# Altium schematic sheet Sheet1_V2.SchDoc
size A; SheetNumber: 1; SheetTotal: 1
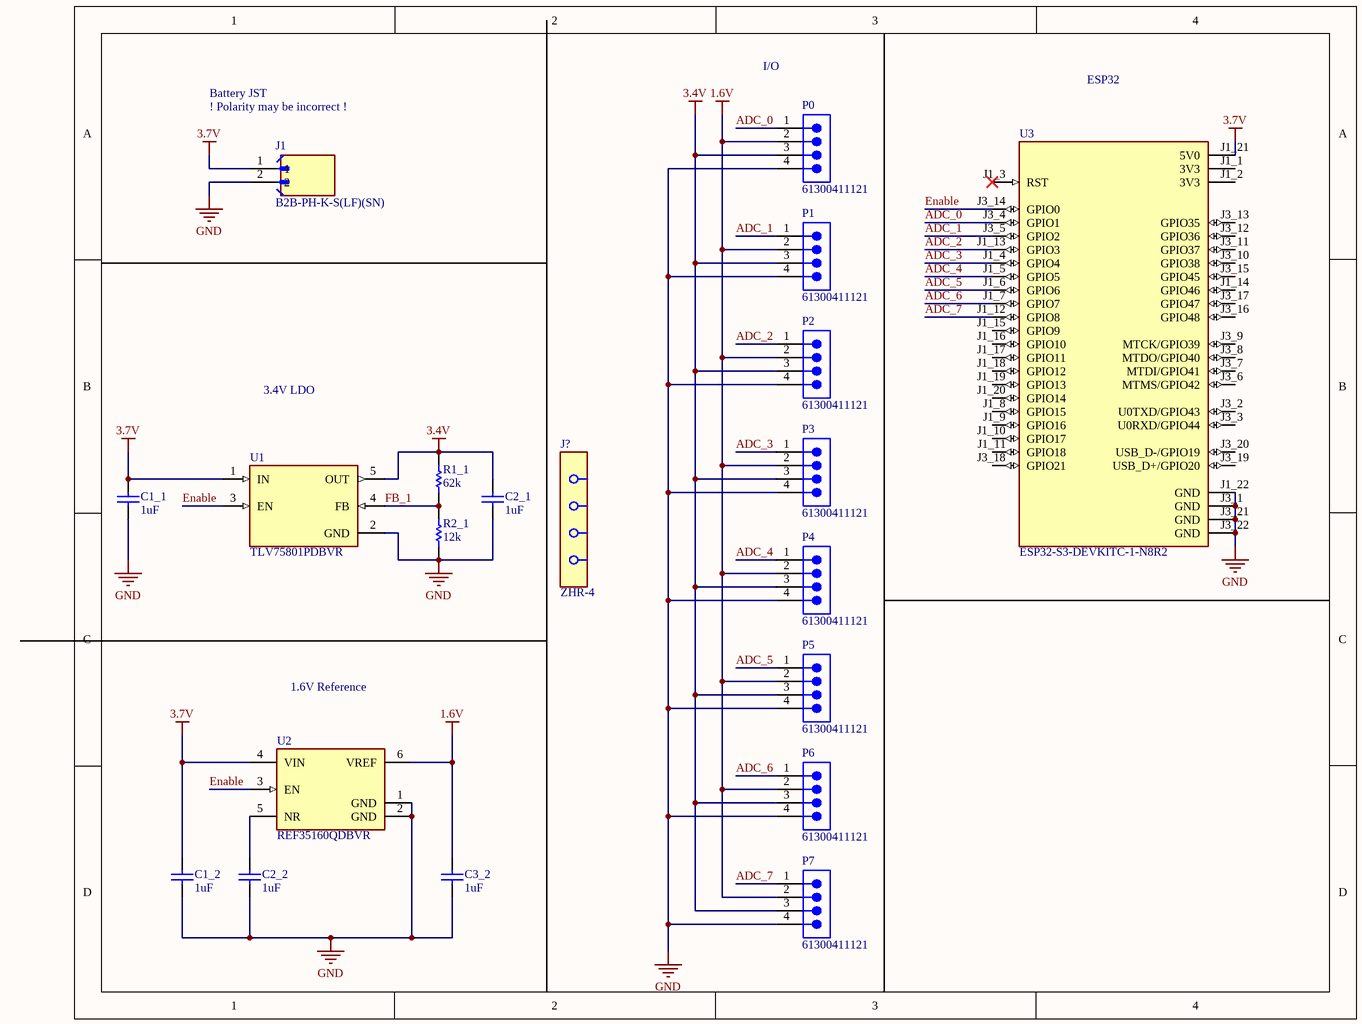
[diagram p0: Sheet1_V2.SchDoc]

## Parts
C1_1  1uF  [CAPC3216X110X50LL20T25]
C1_2  1uF  [CAPC3216X110X50LL20T25]
C2_1  1uF  [CAPC3216X110X50LL20T25]
C2_2  1uF  [CAPC3216X110X50LL20T25]
C3_2  1uF  [CAPC3216X110X50LL20T25]
J1  B2B-PH-K-S(LF)(SN)  [JST_B2B-PH-K-S(LF)(SN)]
J?  ZHR-4  [FP-ZHR-4-MFG]
P0  61300411121  [61300411121]
P1  61300411121  [61300411121]
P2  61300411121  [61300411121]
P3  61300411121  [61300411121]
P4  61300411121  [61300411121]
P5  61300411121  [61300411121]
P6  61300411121  [61300411121]
P7  61300411121  [61300411121]
R1_1  62k  [RESC3216X70X50LL20T25]
R2_1  12k  [RESC3216X70X50NL20T25]
U1  TLV75801PDBVR  [SOT95P280X145-5N]
U2  REF35160QDBVR  [FP-DBV0006A-IPC_A]
U3  ESP32-S3-DEVKITC-1-N8R2  [XCVR_ESP32-S3-DEVKITC-1-N8R2]

## Nets
1.6V: C3_2.2 P0.2 P1.2 P2.2 P3.2 P4.2 P5.2 P6.2 P7.2 U2.6(VREF)
3.4V: C2_1.1 P0.3 P1.3 P2.3 P3.3 P4.3 P5.3 P6.3 P7.3 R1_1.2 U1.5(OUT)
3.7V: C1_1.2 C1_2.2 J1.1 U1.1(IN) U2.4(VIN) U3.J1_21(5V0)
GND: C1_1.1 C1_2.1 C2_1.2 C2_2.1 C3_2.1 J1.2 P0.4 P1.4 P2.4 P3.4 P4.4 P5.4 P6.4 P7.4 R2_1.1 U1.2(GND) U2.1(GND) U2.2(GND) U3.J1_22(GND) U3.J3_1(GND) U3.J3_21(GND) U3.J3_22(GND)
ADC_0: P0.1 U3.J3_4(GPIO1)
ADC_1: P1.1 U3.J3_5(GPIO2)
ADC_2: P2.1 U3.J1_13(GPIO3)
ADC_3: P3.1 U3.J1_4(GPIO4)
ADC_4: P4.1 U3.J1_5(GPIO5)
ADC_5: P5.1 U3.J1_6(GPIO6)
ADC_6: P6.1 U3.J1_7(GPIO7)
ADC_7: P7.1 U3.J1_12(GPIO8)
Enable: U1.3(EN) U2.3(EN) U3.J3_14(GPIO0)
FB_1: R1_1.1 R2_1.2 U1.4(FB)
NetC2_2_2: C2_2.2 U2.5(NR)

Not connected (* = marked no-connect by the designer): U3 J1_1(3V3) J1_2(3V3) J1_3(RST)* J1_8(GPIO15) J1_9(GPIO16) J1_10(GPIO17) J1_11(GPIO18) J1_14(GPIO46) J1_15(GPIO9) J1_16(GPIO10) J1_17(GPIO11) J1_18(GPIO12) J1_19(GPIO13) J1_20(GPIO14) J3_2(U0TXD/GPIO43) J3_3(U0RXD/GPIO44) J3_6(MTMS/GPIO42) J3_7(MTDI/GPIO41) J3_8(MTDO/GPIO40) J3_9(MTCK/GPIO39) J3_10(GPIO38) J3_11(GPIO37) J3_12(GPIO36) J3_13(GPIO35) J3_15(GPIO45) J3_16(GPIO48) J3_17(GPIO47) J3_18(GPIO21) J3_19(USB_D+/GPIO20) J3_20(USB_D-/GPIO19)

## Notes on the sheet
- Battery JST
- I/O
- ESP32
- ! Polarity may be incorrect !
- 3.4V LDO
- 1.6V Reference

## Library data of the parts
C1_1 C1_2 C2_1 C2_2 C3_2 = CMP-2000-06011-1: Chip Capacitor, 1 uF, +/- 10%, 50 V, -55 to 125 degC, 1206 (3216 Metric), RoHS, Tape and Reel; Manufacturer: Kemet; Case Height: 1mm; Dielectric: X7R; Voltage Rating: 50V; Temperature Coefficient / Code: +/-15%; Case Length: 3.2mm; Case Width: 1.6mm; Type: SMDMLCCX7R6.3-250VDCCommericalGrade; Class: Class1; Capacitance - nF: 1000nF; Datasheet URL: http://www.kemet.com/docfinder?Partnumber=C1206C105K5RACTU; Product Category: MultilayerCeramicCapacitorsMLCC-SMD/SMT; Capacitance: 1uF; Termination Style: SMD/SMT; Dimensions: 1.6mmWx3.2mmLx1mmH; Voltage Rating DC: 50V; Datasheet Version: 02/2016; Packaging: Reel; Brand: Kemet; RoHS: Details; Minimum Operating Temperature: -55C; Operating Temperature Range: -55Cto+125C; Package Reference: 1206; Manufacturer URL: http://www.kemet.com/; Product: GeneralTypeMLCCs; Tolerance: 10%; Package Description: 2-Pin Surface Mount Device, Body 3.2 x 1.6 mm; Mounting Technology: SurfaceMount; Case Code - mm: 3216; Maximum Operating Temperature: +125C; Series: C1206C; Factory Pack Quantity: 2500; Package / Case: 1206(3216metric); Case Code - in: 1206
J1 = B2B-PH-K-S(LF)(SN): Connector Header Through Hole 2 position 0.079 (2.00mm); MF: JST; SnapEDA_Link: https://www.snapeda.com/parts/B2B-PH-K-S%20(LF)(SN)/JST/view-part/?ref=snap; Package: None; Value: *; MP: B2B-PH-K-S (LF)(SN); Check_prices: https://www.snapeda.com/parts/B2B-PH-K-S%20(LF)(SN)/JST/view-part/?ref=eda
J? = CMP-17439-000043-1: CONN HOUSING ZH 4POS 1.5MM WHT; Voltage Rating (AC): 50V; Test Voltage: 500V; Number of Contacts: 4; Contact Resistance: 20mR; Gender: Female; Max Current Rating: 1A; Insulation Resistance: 500MR; Panel Thickness: 3.5mm; Connector Type: Receptacle; Housing Material: Polyamide; Insulation Material: Nylon; Packaging: Bulk; Contact Type: Female Socket; Width: 3.4mm; Pitch: 1.5mm; Min Operating Temperature: -25°C; Orientation: Straight; Contact Material: Brass; Max Voltage Rating (AC): 50V; Number of Positions: 4; REACH SVHC: No SVHC; Color: Natural; Mount: Free Hanging; Housing Color: White; Flammability Rating: UL94 V-0; Depth: 4.8mm; Height: 0.28inch; Contact Plating: Tin; Material: Nylon; Number of Rows: 1; Voltage Rating (DC): 50V; Series: ZH; Length: 7.5mm; Weight: 0.0625lb; Termination: Crimp; Max Operating Temperature: 85°C; Current Rating: 1A; Lead Free: Lead Free
P0-P7 = CMP-1502-01064-3: NexarPartId: 32855522; Operating Supply Voltage: 250V; Pitch: 2.54mm; Contact Resistance: 20mΩ; Number of Positions: 4; Current Rating: 3A; Connector Type: Male Pin; Gender: Male; Contact Plating: Gold; Height: 8.89mm; Lead Pitch: 2.54mm; Lead Free: Lead Free; Contact Mating Length: 5.9944mm; Number of Rows: 1; Termination: Solder; Packaging: Bulk; REACH SVHC: Unknown; Min Operating Temperature: -40°C; RoHS: Compliant; Number of Contacts: 4; Voltage Rating: 250V; Color: Black; Max Operating Temperature: 105°C; Contact Material: Copper; Mount: Through Hole; Orientation: Vertical; Number of Pins: 4
R1_1 = CMP-2003-04487-1: Part Number: ERA8AEB623V; Manufacturer: Panasonic
R2_1 = CMP-2003-04416-1: Part Number: ERA8AEB123V; Manufacturer: Panasonic
U1 = TLV75801PDBVR: 500-mA, low-IQ, high-accuracy, adjustable ultra-low-dropout voltage regulator with enable; MF: Texas Instruments; SnapEDA_Link: https://www.snapeda.com/parts/TLV75801PDBVR/Texas+Instruments/view-part/?ref=snap; Package: SOT-23-5 Texas Instruments; Value: *; MP: TLV75801PDBVR; Check_prices: https://www.snapeda.com/parts/TLV75801PDBVR/Texas+Instruments/view-part/?ref=eda
U2 = CMP-04916-000060-1: 650-NA QUIESCENT CURRENT, 12-PPM
U3 = ESP32-S3-DEVKITC-1-N8R2: WiFi Development Tools - 802.11 (Engineering Samples Only) ESP32-S3 General-Purpose Development Board, ESP32-S3-WROOM-1-N8R2, with Pin Header; MF: Espressif Systems; SnapEDA_Link: https://www.snapeda.com/parts/ESP32-S3-DEVKITC-1-N8R2/Espressif+Systems/view-part/?ref=snap; Package: None; Value: *; MP: ESP32-S3-DEVKITC-1-N8R2; Check_prices: https://www.snapeda.com/parts/ESP32-S3-DEVKITC-1-N8R2/Espressif+Systems/view-part/?ref=eda